# Altium schematic sheet CRAFT_Current_Sense_Circuit_AJeffersonRev2.SchDoc
size A
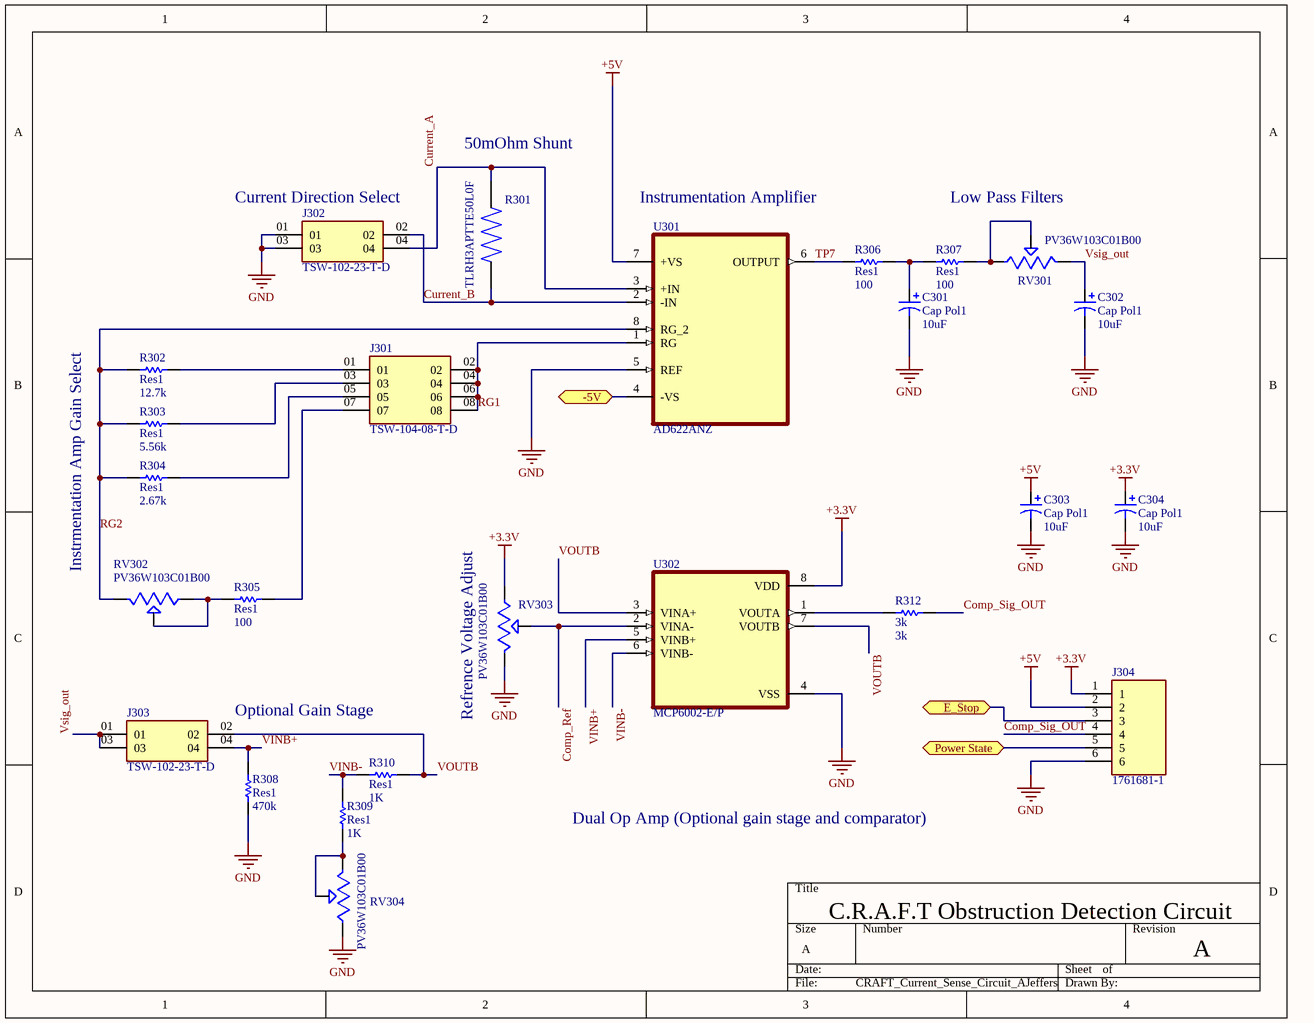
[diagram p0: CRAFT_Current_Sense_Circuit_AJeffersonRev2.SchDoc]

## Parts
C301  Cap Pol1  value 10uF  [CAPPRD250W50D630H1120]
C302  Cap Pol1  value 10uF  [CAPPRD250W50D630H1120]
C303  Cap Pol1  value 10uF  [CAPPRD250W50D630H1120]
C304  Cap Pol1  value 10uF  [CAPPRD250W50D630H1120]
J301  TSW-104-08-T-D  [SAMTEC_TSW-104-08-T-D]
J302  TSW-102-23-T-D  [SAMTEC_TSW-102-23-T-D]
J303  TSW-102-23-T-D  [SAMTEC_TSW-102-23-T-D]
J304  1761681-1  [TE_1761681-1]
R301  TLRH3APTTE50L0F  [RESC6332X70N]
R302  Res1  value 12.7k  [AXIAL-0.3]
R303  Res1  value 5.56k  [AXIAL-0.3]
R304  Res1  value 2.67k  [AXIAL-0.3]
R305  Res1  value 100  [AXIAL-0.3]
R306  Res1  value 100  [AXIAL-0.3]
R307  Res1  value 100  [AXIAL-0.3]
R308  Res1  value 470k  [AXIAL-0.3]
R309  Res1  value 1K  [AXIAL-0.3]
R310  Res1  value 1K  [AXIAL-0.3]
R312  3k  [AXIAL-0.3]
RV301  PV36W103C01B00  [TRIM_PV36W103C01B00]
RV302  PV36W103C01B00  [TRIM_PV36W103C01B00]
RV303  PV36W103C01B00  [TRIM_PV36W103C01B00]
RV304  PV36W103C01B00  [TRIM_PV36W103C01B00]
U301  AD622ANZ  [DIP254P762X533-8]
U302  MCP6002-E/P  [DIP787W46P254L927H533Q8]

## Ports
-5V, E_Stop, Power State (bidir)

## Nets
+3.3V: C304.1 J304.1 RV303.1 U302.8(VDD)
+5V: C303.1 J304.2 U301.7(+VS)
GND: C301.2 C302.2 C303.2 C304.2 J302.01 J302.03 J304.6 R308.1 RV303.3 RV304.1 U301.5(REF) U302.4(VSS)
-5V: U301.4(-VS) ; port -5V
Comp_Ref: RV303.2 U302.2(VINA-)
Comp_Sig_OUT: J304.4 R312.2
Current_A: J302.04 R301.2 U301.3(+IN)
Current_B: J302.02 R301.1 U301.2(-IN)
E_Stop: J304.3 ; port E_Stop
Power State: J304.5 ; port Power State
RG1: J301.02 J301.04 J301.06 J301.08 U301.1(RG)
RG2: R302.1 R303.1 R304.1 RV302.3 U301.8(RG_2)
TP7: R306.1 U301.6(OUTPUT)
VINB+: J303.04 R308.2 U302.5(VINB+)
VINB-: R309.2 R310.1 U302.6(VINB-)
VOUTB: J303.02 R310.2 U302.3(VINA+) U302.7(VOUTB)
Vsig_out: C302.1 J303.01 J303.03 RV301.3
NetC301_1: C301.1 R306.2 R307.1
NetJ301_01: J301.01 R302.2
NetJ301_03: J301.03 R303.2
NetJ301_05: J301.05 R304.2
NetJ301_07: J301.07 R305.2
NetR305_1: R305.1 RV302.1 RV302.2
NetR307_2: R307.2 RV301.1 RV301.2
NetR309_1: R309.1 RV304.2 RV304.3
NetR312_1: R312.1 U302.1(VOUTA)

## Notes on the sheet
- 50mOhm Shunt
- (near J302) Current Direction Select
- Instrumentation Amplifier
- Low Pass Filters
- Instrmentation Amp Gain Select
- (near J303) Optional Gain Stage
- (near RV303) Refrence Voltage Adjust
- Dual Op Amp (Optional gain stage and comparator)
- C.R.A.F.T Obstruction Detection Circuit
- A

## Library data of the parts
C301-C304 = Cap Pol1: Polarized Capacitor (Radial); pin to pad: 1>P 2>N; Published: 8-Jun-2000; LatestRevisionDate: 17-Jul-2002; LatestRevisionNote: Re-released for DXP Platform.; PackageReference: RB7.6-15; Publisher: Altium Limited; PackageDescription: Polarized Capacitor (Radial); 2 Leads
J304 = 1761681-1: MF: {'manufacturer': 'TE Connectivity'}; Package: None; MP: 1761681-1; Price: None; Value: *; Availability: Unavailable
R301 = TLRH3APTTE47L0F: Res Metal Plate 2512 0.047 Ohm 1% 4W Â±50ppm/C Pad SMD Automotive T/R; Package: None; Price: None; Value: *; MP: TLRH3APTTE47L0F; Availability: Unavailable
R302-R310 R312 = Res1: Resistor; Published: 8-Jun-2000; LatestRevisionDate: 17-Jul-2002; LatestRevisionNote: Re-released for DXP Platform.; PackageReference: AXIAL-0.3; Publisher: Altium Limited; PackageDescription: Axial Device, Thru-Hole; 2 Leads; 0.3 in Pin Spacing
  R312: Value: 3k
RV301-RV304 = PV36W103C01B00: 10 kOhms 0.5W, 1/2W PC Pins Through Hole Trimmer Potentiometer Cermet 25 Turn Top Adjustment; MF: Bourns; Availability: Unavailable; MP: PV36W103C01B00; Price: None; Value: *; SnapEDA_Link: https://www.snapeda.com/parts/PV36W103C01B00/Bourns/view-part/1439094/?ref=snap; Package: 6332 Bourns
U301 = AD622ANZ: Instrumentation Amplifier 1 Circuit 8-PDIP; MF: Analog Devices; MP: AD622ANZ; Availability: Unavailable; SnapEDA_Link: https://www.snapeda.com/parts/AD622ANZ/Analog%20Devices%20Inc./view-part/207874/?ref=snap; Package: PDIP-8 Analog Devices; Price: None; Value: *
U302 = MCP6002-E/P: General Purpose Amplifier 2 Circuit Rail-to-Rail 8-PDIP; MF: Microchip; Value: *; Availability: Unavailable; Price: None; MP: MCP6002-E/P; Package: DIP-8 Microchip; SnapEDA_Link: https://www.snapeda.com/parts/MCP6002-E/P/Microchip/view-part/228325/?ref=snap
J301 = TSW-104-08-T-D: Package: None; Price: None; Value: *; MP: TSW-104-08-T-D; Availability: Unavailable
J302 J303 = TSW-102-23-T-D: Package: None; Price: None; Value: *; MP: TSW-102-23-T-D; Availability: Unavailable